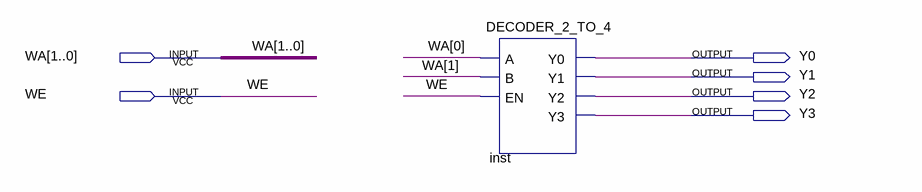
[diagram p0: schematic sheet]
// Quartus schematic DECODER_2TO4.bdf as structural Verilog: 1 symbols, 6 pins
module DECODER_2TO4 (
  input  [1:0] WA,
  input  WE,
  output Y0,
  output Y1,
  output Y2,
  output Y3
);

  DECODER_2_TO_4 inst (.A(WA[0]), .B(WA[1]), .EN(WE), .Y0(Y0), .Y1(Y1), .Y2(Y2), .Y3(Y3));
endmodule
